# EAGLE design OLED Display (EAGLE 9.6.2)
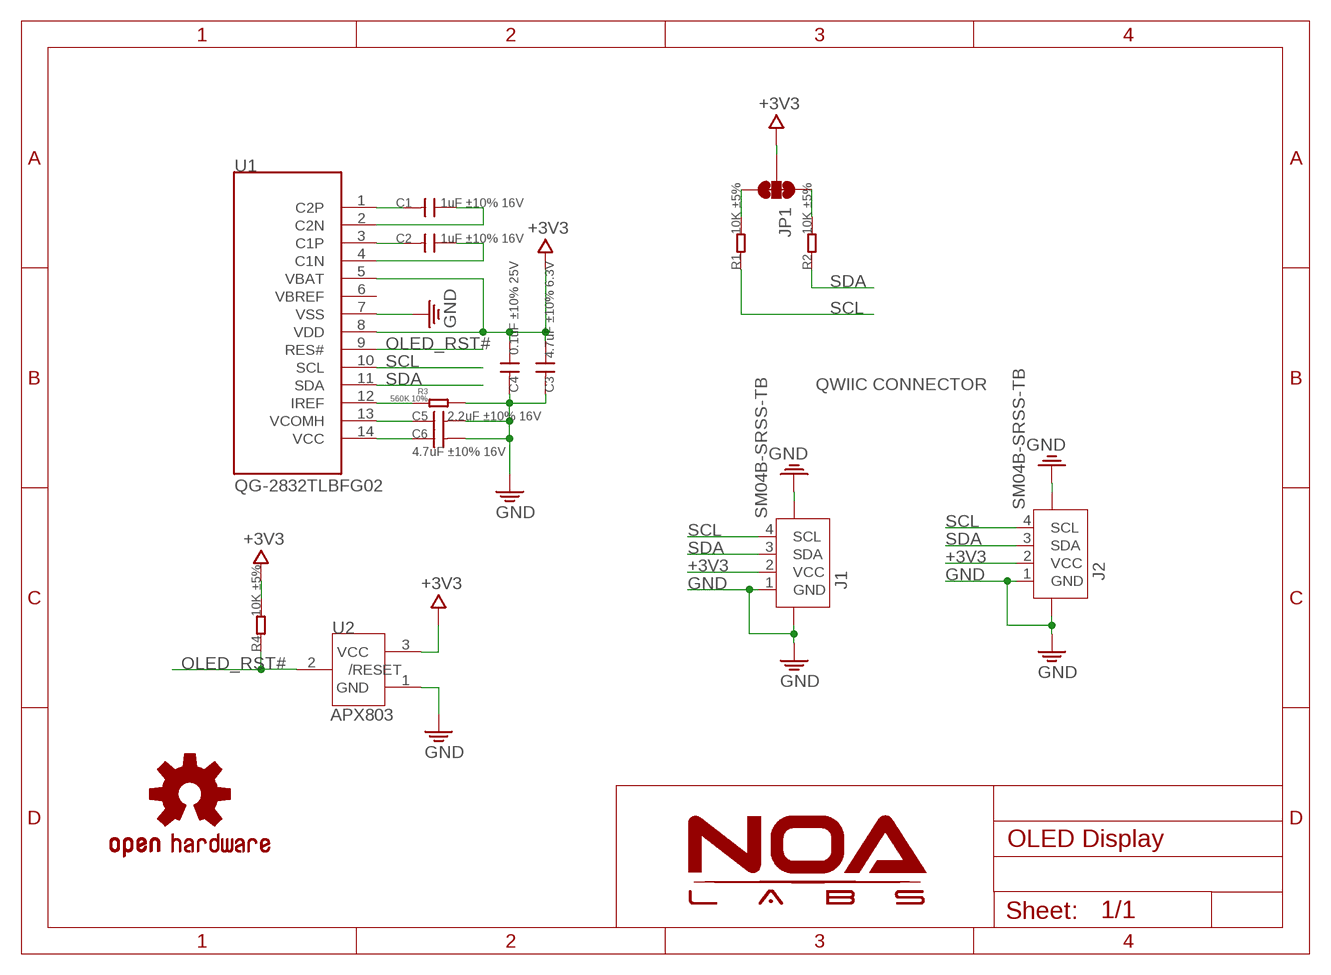
[diagram p0: schematic, sheet 1]

## Parts
C1  1uF ±10% 16V  C-0603  [0603]
C2  1uF ±10% 16V  C-0603  [0603]
C3  4.7uF ±10% 6.3V  C-0603  [0603]
C4  0.1uF ±10% 25V  C-0603  [0603]
C5  2.2uF ±10% 16V  C-0603  [0603]
C6  4.7uF ±10% 16V  C-0603  [0603]
J1  SM04B-SRSS-TB  JST-SH-4P-1.0  [JST-SH-4P]
J2  SM04B-SRSS-TB  JST-SH-4P-1.0  [JST-SH-4P]
JP1  SMT-JUMPER_3_2-NC_TRACE  [SMT-JUMPER_3_2-NC_TRACE]
LOGO2  OSHW-LOGOMINI  [OSHW-LOGO-MINI]
R1  10K ±5%  R-0603  [0603]
R2  10K ±5%  R-0603  [0603]
R3  560K 10%  R-0603  [0603]
R4  10K ±5%  R-0603  [0603]
U1  QG-2832TLBFG02  OLED-12832  [OLED-12832]
U2  APX803  [SOT23]

## Nets
+3V3: C3.1 C4.1 J1.2(VCC) J2.2(VCC) JP1.2 R4.2 U1.5(VBAT) U1.8(VDD) U2.3(VCC)
GND: C3.2 C4.2 C5.2 C6.2 J1.1(GND) J1.NC1 J1.NC2 J2.1(GND) J2.NC1 J2.NC2 R3.1 U1.7(VSS) U2.1(GND)
N$1: C1.2 U1.1(C2P)
N$2: C1.1 U1.2(C2N)
N$3: C2.2 U1.3(C1P)
N$4: C2.1 U1.4(C1N)
N$5: JP1.3 R1.2
N$6: C5.1 U1.13(VCOMH)
N$7: C6.1 U1.14(VCC)
N$8: JP1.1 R2.2
N$9: R3.2 U1.12(IREF)
OLED_RST#: R4.1 U1.9(RES#) U2.2(/RESET)
SCL: J1.4(SCL) J2.4(SCL) R1.1 U1.10(SCL)
SDA: J1.3(SDA) J2.3(SDA) R2.1 U1.11(SDA)
Unconnected: U1.6(VBREF)

## Notes on the sheet
- QWIIC CONNECTOR

## Library data of the parts
C1-C6 = Discrete:C*: Ceramic Capacitors
J1 J2 = Connector:JST-SH-4P
JP1 = NOA-Jumpers:SMT-JUMPER_3_2-NC_TRACE
LOGO2 = OSHW-LOGO-M:OSHW-LOGO: Open-Source Hardware (OSHW) Logo This logo indicates the piece of hardware it is found on incorporates a OSHW license and/or adheres to the definition of open source hardware found here: http://freedomdefined.org/OSHW
R1-R4 = Discrete:R*
U1 = Module:OLED-12832
U2 = IC:APX803

## Board
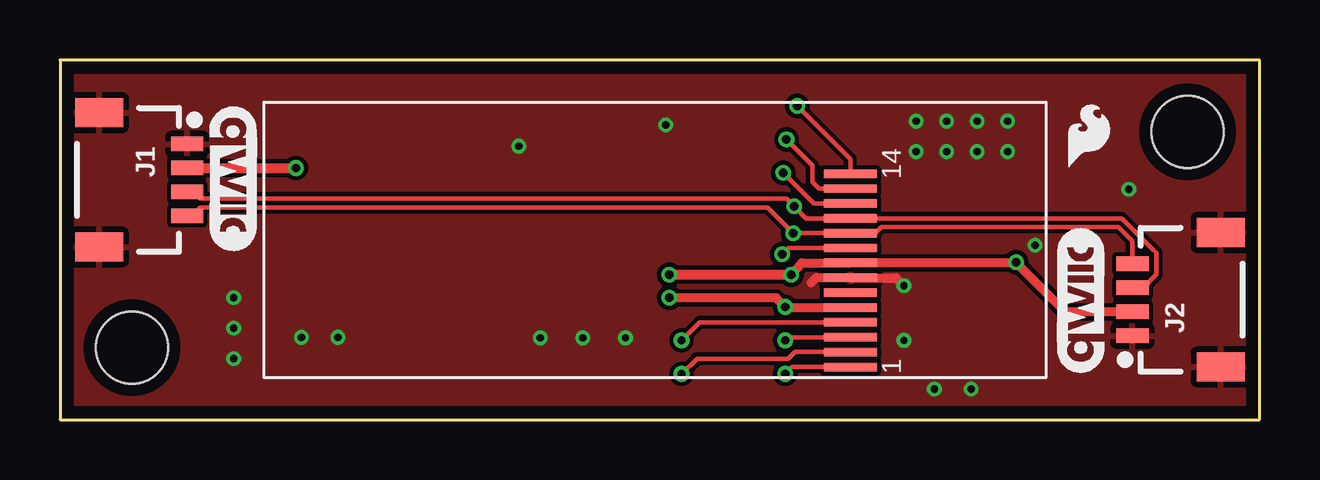
[diagram p1: board, top side]
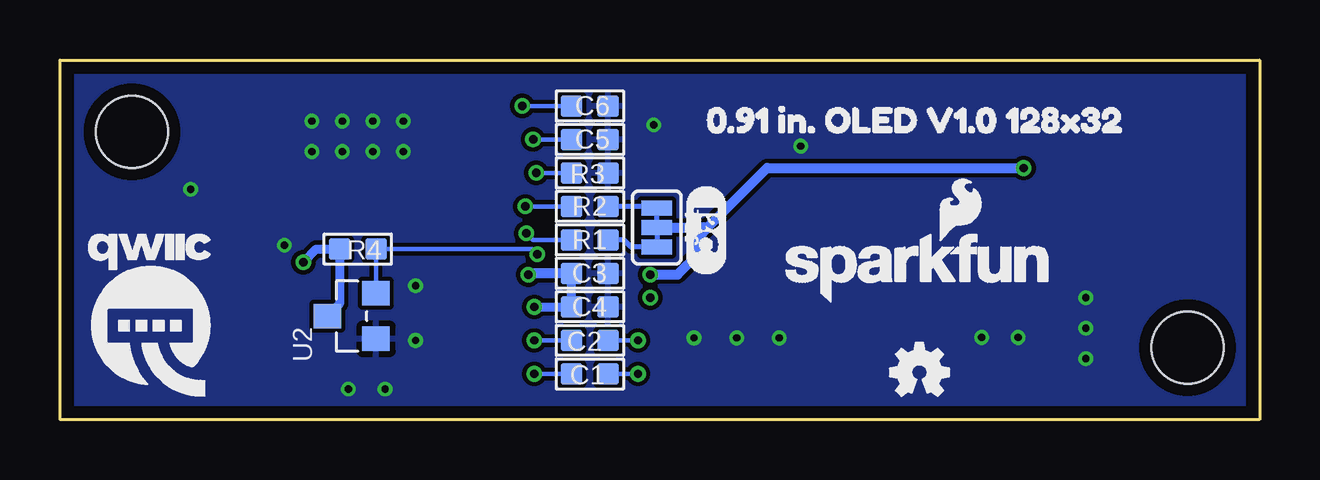
[diagram p2: board, bottom side, seen from below]

Size 50 x 15 mm. Coordinates in mm from the lower left corner, seen from the top.
Outline: 0,0 50,0 50,15 0,15 0,0
Copper layers (1*16): Top 0.035mm / dielectric 1.5mm / Bottom 0.035mm
Design rules "NOA Eagle Rule": minimum track width 7mil, minimum drill 12mil, track to track 7mil, track to pad 7mil, pad to pad 7mil, via to via 7mil, smd to smd 0mil, copper to edge 20mil, drill to drill 10mil, minimum pad ring 10mil, minimum via ring 6mil, stop-mask expansion 2mil, vias tented up to drill 25mil, thermal gap 10mil
Holes 3 mm at 3,3 47,12

### Footprints (pad centres in the part's own frame; a part is rotated, then mirrored left to right if it is on the bottom)
0603 = smd 0.889 x 0.889: 1 -0.762,0; 2 0.762,0
JST-SH-4P = smd 0.6 x 1.35: 1 1.5,0; 2 0.5,0; 3 -0.5,0; 4 -1.5,0 | smd 1.2 x 2: NC1 -2.8,3.675; NC2 2.8,3.675
SMT-JUMPER_3_2-NC_TRACE = smd 0.635 x 1.27: 1 -0.813,0; 2 0,0; 3 0.813,0
OLED-12832 = smd 2.2 x 0.35: 1 24.445,0.445; 2 24.445,1.065; 3 24.445,1.685; 4 24.445,2.305; 5 24.445,2.925; 6 24.445,3.545; 7 24.445,4.165; 8 24.445,4.785; 9 24.445,5.405; 10 24.445,6.025; 11 24.445,6.645; 12 24.445,7.265; 13 24.445,7.885; 14 24.445,8.505
SOT23 = smd 1.016 x 1.143: 1 -0.95,-1.016; 2 0.95,-1.016; 3 0,1.016

### Placement (x,y rotation side)
C1  27.91,1.91 180 bottom
C2  27.91,3.3 180 bottom
C3  27.91,6.1 0 bottom
C4  27.91,4.7 0 bottom
C5  27.91,11.68 0 bottom
C6  27.91,13.08 0 bottom
J1  5.3,10 90 top
J2  44.7,5 270 top
JP1  25.12,8.01 270 bottom
LOGO2  14.17,1.98 0 bottom
R1  27.91,7.49 0 bottom
R2  27.91,8.89 0 bottom
R3  27.91,10.29 180 bottom
R4  37.59,7.11 180 bottom
U1  8.5,1.75 0 top
U2  37.85,4.32 90 bottom
U$6  [QWIIC-LOGO-MEDIUM]  46.28,4.42 0 bottom
U$7  [0#91_IN#_OLED_V1#0_128X320]  23.98,12.5 0 bottom
U$8  [SFE_LOGO_FLAME_.1]  42.88,11.86 0 top
U$9  [SFE_LOGO_NAME_FLAME_.1]  14.2,6.35 0 bottom
U$11  [QWIIC_6MM]  42.55,5 90 top
U$12  [QWIIC_6MM]  7.21,10.01 270 top
U$20  [I_SUPER2_C-()-04]  23.06,9.8 270 bottom

### Tracks (layer width: path | path; a pad name or v marks a point on that pad's centre or on a via)
+3V3  (via drill 0.35)
  Top 0.381: v30.48,6.04 30.92,6.54 U1.8 39.83,6.54 v39.85,6.56 41.91,4.5 J2.2 | U1.5 30.25,4.67 v30.23,4.7 29.84,5.08 v25.4,5.08
  Top 0.406: v25.4,6.04 v30.48,6.04 | J1.2 v9.82,10.5 v9.83,10.49
  Bottom 0.381: C3.1 C4.1 v30.23,4.7 | v39.85,6.56 39.85,6.58 39.32,7.11 R4.2 38.35,4.83 U2.3
  Bottom 0.406: 23.01,8 23.32,8 | v9.83,10.49 20.52,10.49 23.01,8 | 23.77,8 23.32,8 | 23.77,8 24.69,8 24.7,8.01 JP1.2 | 23.32,8 23.39,7.92 23.39,6.91 24.26,6.04 v25.4,6.04 | 23.01,8 23.39,7.62 23.77,8 | C3.1 30.43,6.1 v30.48,6.04
GND  (via drill 0.3)
  Top 0.381: v35.18,5.59 34.85,5.92 U1.7 31.52,5.92 31.32,5.71
  other vias: 35.18,3.3 40.64,7.26 35.69,12.45 36.96,12.45 38.23,12.45 39.5,12.45 39.5,11.18 38.23,11.18 36.96,11.18 35.69,11.18 36.45,1.27 37.97,1.27 44.55,9.6 23.57,3.4 21.79,3.4 20.02,3.4 11.58,3.43 10.06,3.43 7.24,5.08 7.24,3.81 7.24,2.54 25.25,12.29 19.13,11.4
  pour Top: 0,0 49.99,0 49.99,14.99 0,14.99
  pour Bottom: 0,0 50.01,0 50.01,14.99 0,14.99
N$1  (via drill 0.35)
  Top 0.178: U1.1 30.52,2.19 v30.23,1.91
  Bottom 0.178: v30.23,1.91 C1.2
N$2  (via drill 0.35)
  Top 0.178: U1.2 30.63,2.81 30.35,2.54 26.54,2.54 v25.91,1.91
  Bottom 0.178: v25.91,1.91 C1.1
N$3  (via drill 0.35)
  Top 0.178: U1.3 30.36,3.44 v30.23,3.3
  Bottom 0.178: v30.23,3.3 C2.2
N$4  (via drill 0.35)
  Top 0.178: U1.4 26.66,4.05 v25.91,3.3
  Bottom 0.178: v25.91,3.3 C2.1
N$5
  Bottom 0.203: R1.2 26.49,7.49 26.2,7.2 JP1.3
N$6  (via drill 0.35)
  Top 0.178: U1.13 31.64,9.63 31.37,9.91 31.37,10.59 v30.28,11.68
  Bottom 0.178: v30.28,11.68 C5.1
N$7  (via drill 0.35)
  Top 0.178: U1.14 32.95,10.87 v30.73,13.08
  Bottom 0.178: v30.73,13.08 C6.1
N$8
  Bottom 0.203: JP1.1 25.19,8.89 R2.2
N$9  (via drill 0.35)
  Top 0.178: U1.12 31.42,9.02 v30.15,10.29
  Bottom 0.178: R3.2 v30.15,10.29
OLED_RST#  (via drill 0.35)
  Top 0.178: U1.9 30.36,7.16 v30.11,6.9
  Bottom 0.178: R4.1 | R4.1 30.32,7.11 v30.11,6.9 | U2.2 R4.1
SCL  (via drill 0.35)
  Top 0.178: J1.4 5.54,8.54 5.84,8.84 29.49,8.84 v30.56,7.78 U1.10 33.99,7.78 34.24,8.03 44.12,8.03 44.7,7.45 J2.4
  Bottom 0.178: R1.1 30.28,7.49 v30.56,7.78
SDA  (via drill 0.35)
  Top 0.178: J1.3 5.51,9.54 5.84,9.21 30.29,9.21 v30.61,8.89 31.1,8.39 32.87,8.39 U1.11 44.26,8.39 45.59,7.06 45.7,6.96 45.7,6.04 45.15,5.5 J2.3
  Bottom 0.178: R2.1 v30.61,8.89

### Text on the board
tPlace: 14 | 1
bPlace: C:/Users/NOA-01/Documents/eagle/Eagle/ulp/logo/NOA Logo - for Screen - 1000x435 + White Background Mirror.bmp